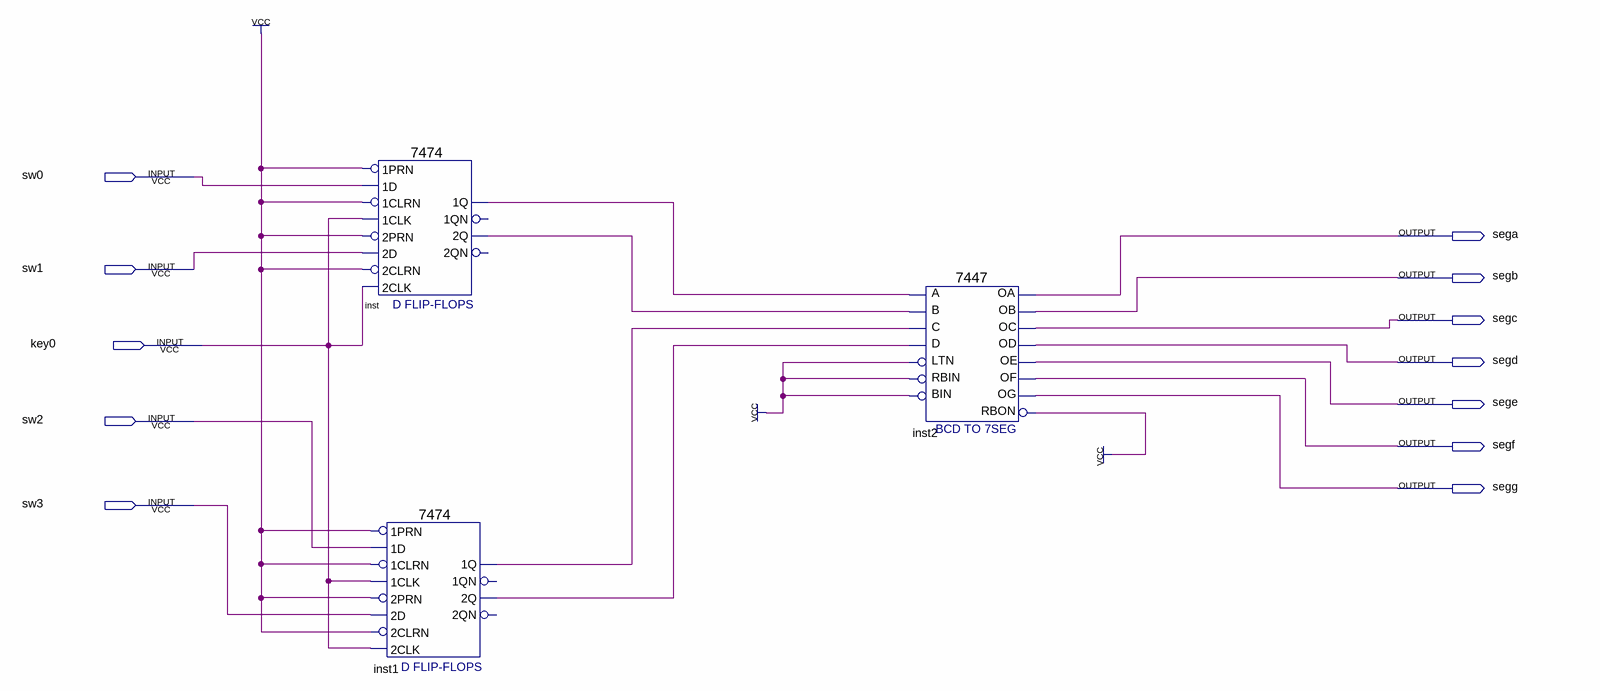
[diagram p0: schematic sheet]
// Quartus schematic Lab1_parta.bdf as structural Verilog: 3 symbols, 12 pins
module Lab1_parta (
  input  sw0,
  input  sw1,
  input  key0,
  input  sw2,
  input  sw3,
  output sega,
  output segb,
  output segc,
  output segd,
  output sege,
  output segf,
  output segg
);

  wire inst1_1q, inst1_2q, inst2_rbon, inst_1q, inst_2q;

  \7474  inst (
    .\2D (sw1), .\2PRN (1'b1), .\1CLK (key0), .\1D (sw0), .\1PRN (1'b1), .\2CLK (key0), .\2CLRN (1'b1),
    .\1CLRN (1'b1), .\2Q (inst_2q), .\1Q (inst_1q));  // open: 1QN, 2QN
  \7474  inst1 (
    .\2D (sw3), .\2PRN (1'b1), .\1CLK (key0), .\1D (sw2), .\1PRN (1'b1), .\2CLK (key0), .\2CLRN (1'b1),
    .\1CLRN (1'b1), .\2Q (inst1_2q), .\1Q (inst1_1q));  // open: 1QN, 2QN
  \7447  inst2 (
    .LTN(1'b1), .B(inst_2q), .C(inst1_1q), .D(inst1_2q), .RBIN(1'b1), .BIN(1'b1), .A(inst_1q), .OB(segb),
    .OC(segc), .OE(sege), .OD(segd), .OF(segf), .OG(segg), .OA(sega), .RBON(inst2_rbon));
  // also tied to VCC on the sheet: inst2_rbon
endmodule
